# EAGLE schematic cloudArray2 (EAGLE 9.5.1)

## Sheet 1 of 13
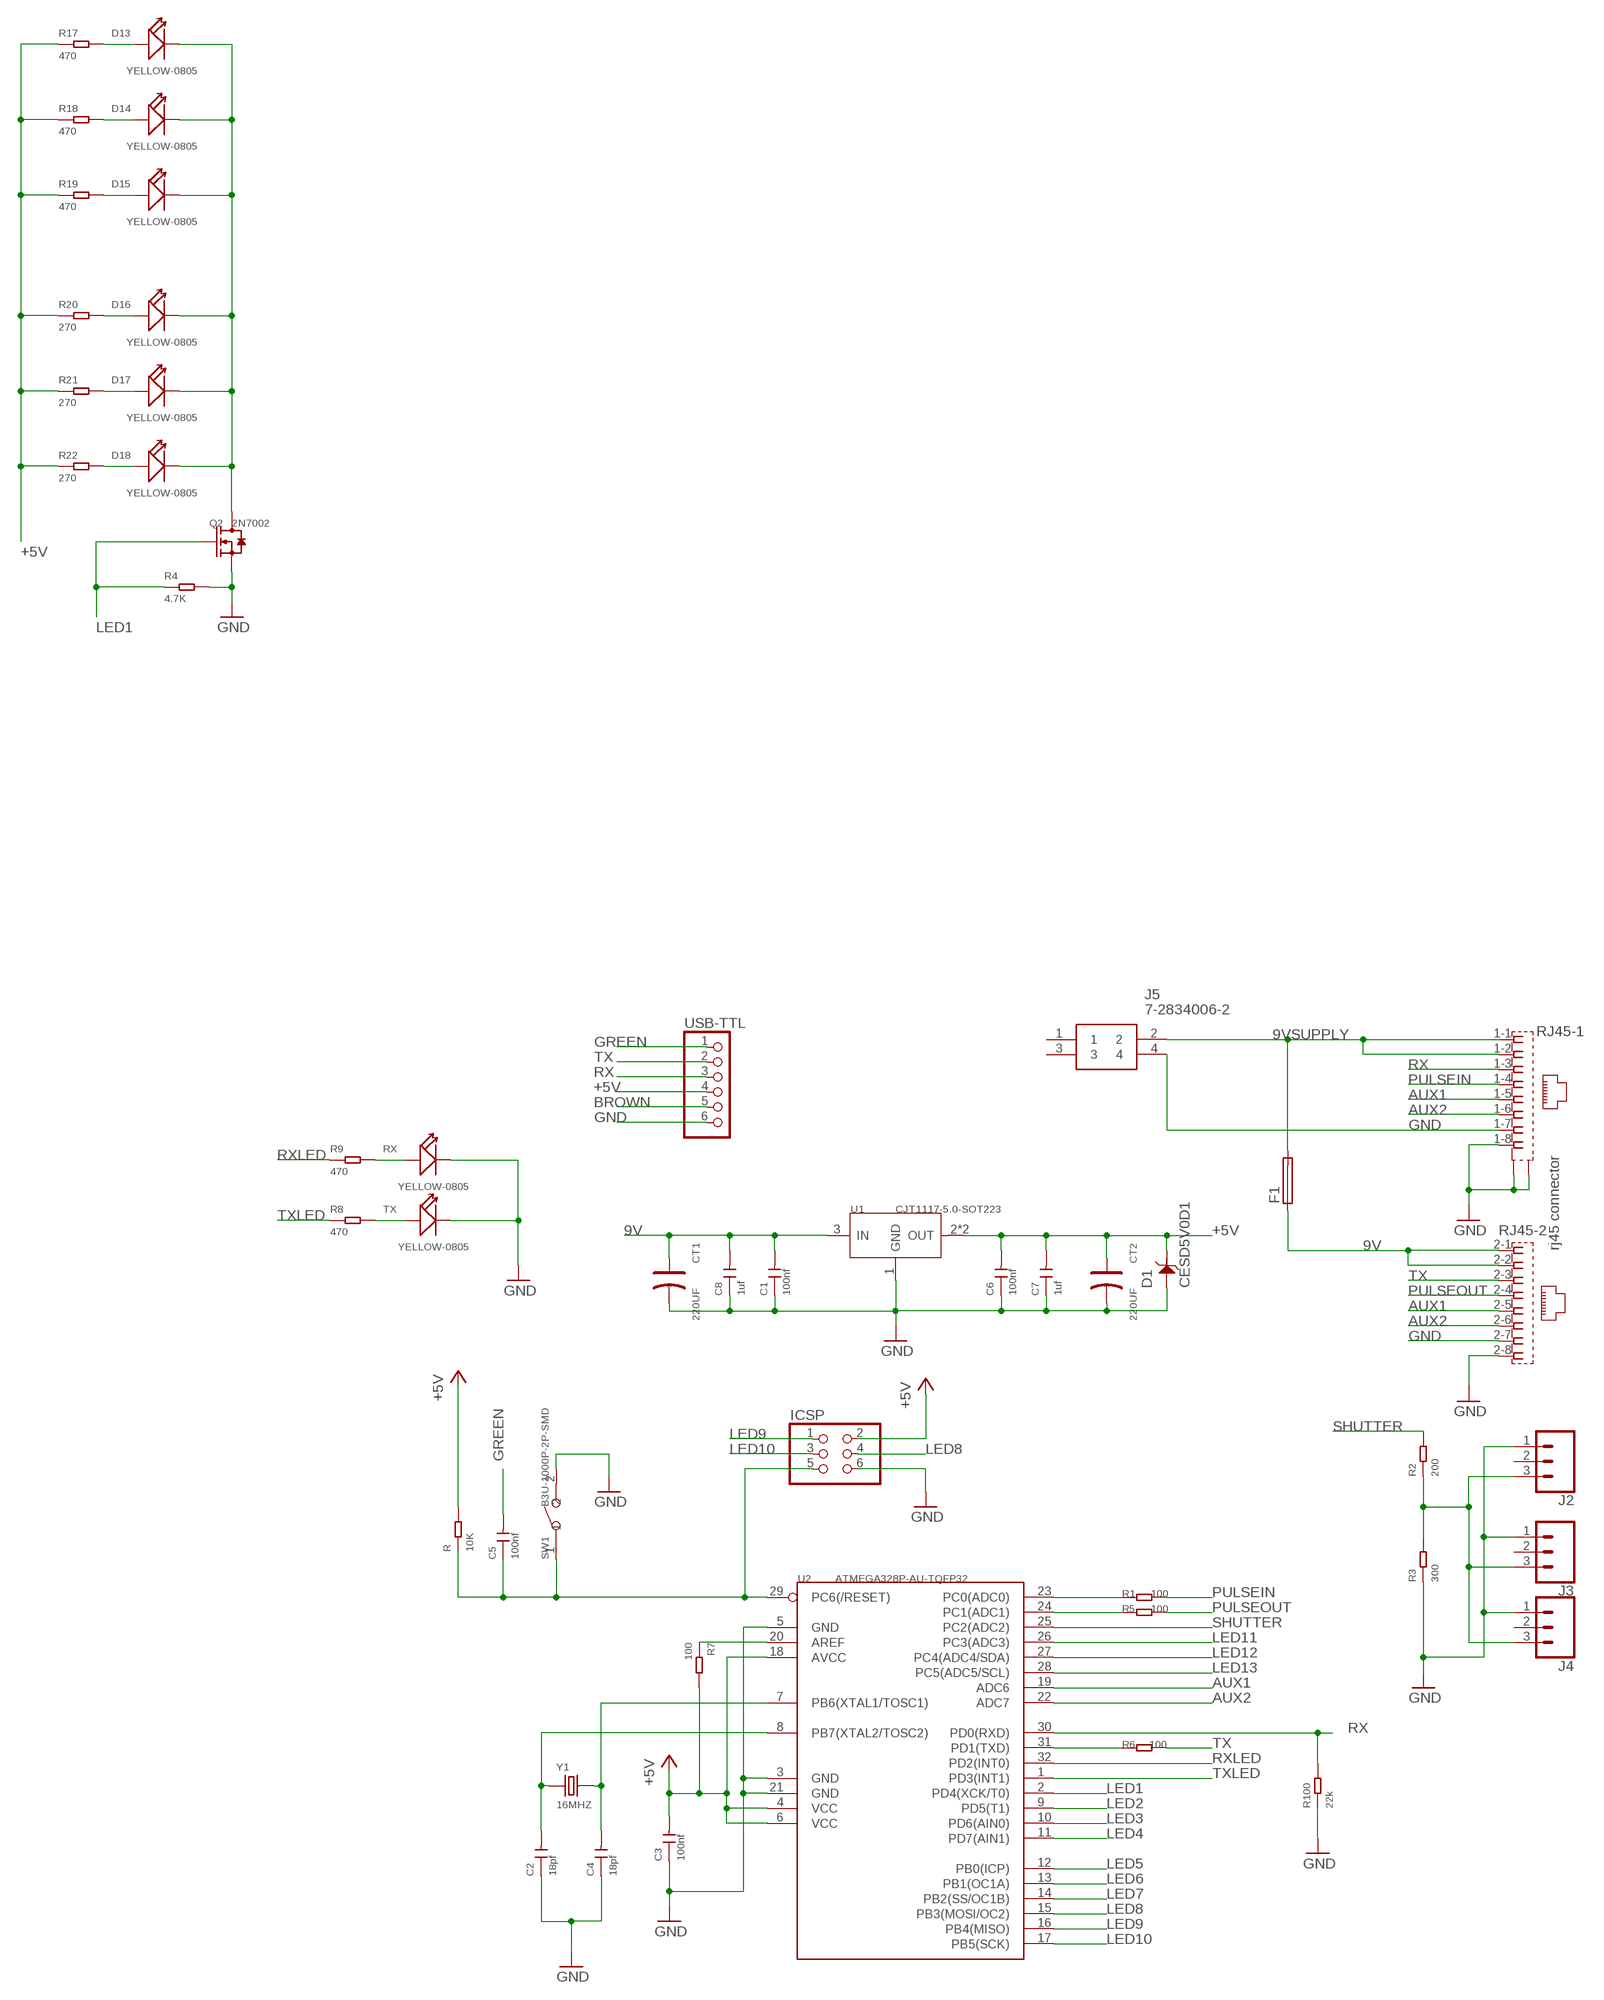
[diagram p0: schematic, sheet 1]

### Parts
C1  100nf  CERAMIC-100NF-50V-10%-X7R(0805)  [C0805]
C2  18pf  CERAMIC-1UF-25V-10%-X7R(0805)  [C0805]
C3  100nf  CERAMIC-10NF-50V-5%-X7R(0805)  [C0805]
C4  18pf  CERAMIC-1UF-25V-10%-X7R(0805)  [C0805]
C5  100nf  CERAMIC-100NF-50V-10%-X7R(0805)  [C0805]
C6  100nf  CERAMIC-100NF-50V-10%-X7R(0805)  [C0805]
C7  1uf  CERAMIC-100NF-50V-10%-X7R(0805)  [C0805]
C8  1uf  CERAMIC-100NF-50V-10%-X7R(0805)  [C0805]
CT1  220UF  ALUMINUM-SMD-220UF-16V(D6.3-H7.7MM)  [ELECTRO-SMD-C-6MM]
CT2  220UF  ALUMINUM-SMD-220UF-16V(D6.3-H7.7MM)  [ELECTRO-SMD-C-6MM]
D1  CESD5V0D1  SMD-DIODE-ESD-6.2V-250MW(SOD-123)  [SOD-123]
D13  YELLOW-0805  SMD-LED-CLEAR-YELLOW(0805)  [LED-0805]
D14  YELLOW-0805  SMD-LED-CLEAR-YELLOW(0805)  [LED-0805]
D15  YELLOW-0805  SMD-LED-CLEAR-YELLOW(0805)  [LED-0805]
D16  YELLOW-0805  SMD-LED-CLEAR-YELLOW(0805)  [LED-0805]
D17  YELLOW-0805  SMD-LED-CLEAR-YELLOW(0805)  [LED-0805]
D18  YELLOW-0805  SMD-LED-CLEAR-YELLOW(0805)  [LED-0805]
F1  SH22,5A  [SH22,5A]
ICSP  PINHD-2X3  [2X03]
J2  455-1750-1-ND  CONN_03  [1X03]
J3  455-1750-1-ND  CONN_03  [1X03]
J4  455-1750-1-ND  CONN_03  [1X03]
J5  7-2834006-2  [728340062]
Q2  2N7002  SMD-MOSFET-N-CH-60V-300MA-LOGIC-LEVEL-FET-2N7002(SOT-23)  [SOT-23]
R  10K  SMD-RES-10K-1%-1/8W(0805)  [R0805]
R1  100  SMD-RES-200R-1%-1/8W(0805)  [R0805]
R2  200  SMD-RES-200R-1%-1/8W(0805)  [R0805]
R3  300  SMD-RES-200R-1%-1/8W(0805)  [R0805]
R4  4.7K  SMD-RES-2.4K-5%-1/8W(0805)  [R0805]
R5  100  SMD-RES-200R-1%-1/8W(0805)  [R0805]
R6  100  SMD-RES-200R-1%-1/8W(0805)  [R0805]
R7  100  SMD-RES-200R-1%-1/8W(0805)  [R0805]
R8  470  SMD-RES-470R-1%-1/8W(0805)  [R0805]
R9  470  SMD-RES-470R-1%-1/8W(0805)  [R0805]
R17  470  SMD-RES-470R-1%-1/8W(0805)  [R0805]
R18  470  SMD-RES-470R-1%-1/8W(0805)  [R0805]
R19  470  SMD-RES-470R-1%-1/8W(0805)  [R0805]
R20  270  SMD-RES-470R-1%-1/8W(0805)  [R0805]
R21  270  SMD-RES-470R-1%-1/8W(0805)  [R0805]
R22  270  SMD-RES-470R-1%-1/8W(0805)  [R0805]
R100  22k  SMD-RES-200R-1%-1/8W(0805)  [R0805]
RJ45  557570-1  [557570-1]
RX  YELLOW-0805  SMD-LED-CLEAR-YELLOW(0805)  [LED-0805]
SW1  B3U-1000P-2P-SMD  SMD-BUTTON(2P-3.0X2.5X1.2+0.4MM)-B3U-1000P-2P-SMD  [SW2-2.6-3.0X2.5X1.2+0.4MM]
TX  YELLOW-0805  SMD-LED-CLEAR-YELLOW(0805)  [LED-0805]
U1  CJT1117-5.0-SOT223  PMIC-CJT1117-5.0(SOT223)  [SOT-223]
U2  ATMEGA328P-AU-TQFP32  MCU-ATMEGA328P-AU(TQFP32)  [TQFP32-0.8-7X7MM]
USB-TTL  PINHD-1X6  [1X06]
Y1  16MHZ  SMD-CRYSTAL-16MHZ-8PF-20PPM-40R(2P-5.0X3.2MM)  [X2-SMD-5.0X3.2X1.3MM]

### Nets
9V: C1.2 C8.2 CT1.+ F1.1 RJ45.2-1 RJ45.2-2 U1.3(IN)
9VSUPPLY: F1.2 J5.2 RJ45.1-1 RJ45.1-2
+5V: C3.2 C6.2 C7.2 CT2.+ D1.- ICSP.2 R7.2 R17.1 R18.1 R19.1 R20.1 R21.1 R22.1 R.2 U1.2(OUT) U1.TER(OUT) U2.4(VCC) U2.6(VCC) U2.18(AVCC) USB-TTL.4 ; also sheet 2,3,4,5,6,7,8,9,10,11,12,13
A0: R1.2 U2.23(PC0(ADC0))
A1: R5.2 U2.24(PC1(ADC1))
AREF: R7.1 U2.20(AREF)
AUX1: RJ45.1-5 RJ45.2-5 U2.19(ADC6)
AUX2: RJ45.1-6 RJ45.2-6 U2.22(ADC7)
BROWN: USB-TTL.5
GND: C1.1 C2.1 C3.1 C4.1 C6.1 C7.1 C8.1 CT1.- CT2.- D1.+ ICSP.6 J2.1 J3.1 J4.1 J5.4 Q2.2(S) R3.1 R4.2 R100.1 RJ45.1-7 RJ45.1-8 RJ45.2-7 RJ45.2-8 RJ45.G1(-1:S2) RJ45.G3(-1:S1) RX.- SW1.2 TX.- U1.1(GND) U2.3(GND) U2.5(GND) U2.21(GND) USB-TTL.6 ; also sheet 2,3,4,5,6,7,8,9,10,11,12,13
GREEN: C5.2 USB-TTL.1
LED1: Q2.1(G) R4.1 U2.2(PD4(XCK/T0))
LED2: U2.9(PD5(T1)) ; also sheet 2
LED3: U2.10(PD6(AIN0)) ; also sheet 3
LED4: U2.11(PD7(AIN1)) ; also sheet 4
LED5: U2.12(PB0(ICP)) ; also sheet 5
LED6: U2.13(PB1(OC1A)) ; also sheet 6
LED7: U2.14(PB2(SS/OC1B)) ; also sheet 7
LED8: ICSP.4 U2.15(PB3(MOSI/OC2)) ; also sheet 8
LED9: ICSP.1 U2.16(PB4(MISO)) ; also sheet 9
LED10: ICSP.3 U2.17(PB5(SCK)) ; also sheet 10
LED11: U2.26(PC3(ADC3)) ; also sheet 11
LED12: U2.27(PC4(ADC4/SDA)) ; also sheet 12
LED13: U2.28(PC5(ADC5/SCL)) ; also sheet 13
N$1: D13.- D14.- D15.- D16.- D17.- D18.- Q2.3(D)
N$3: C2.2 U2.8(PB7(XTAL2/TOSC2)) Y1.1
N$4: C4.2 U2.7(PB6(XTAL1/TOSC1)) Y1.2
N$5: R6.2 U2.31(PD1(TXD))
N$13: R8.2 TX.+
N$20: J2.3 J3.3 J4.3 R2.1 R3.2
N$30: R9.2 RX.+
N$152: D13.+ R17.2
N$153: D14.+ R18.2
N$154: D15.+ R19.2
N$155: D16.+ R20.2
N$156: D17.+ R21.2
N$157: D18.+ R22.2
PULSEIN: R1.1 RJ45.1-4
PULSEOUT: R5.1 RJ45.2-4
RESET: C5.1 ICSP.5 R.1 SW1.1 U2.29(PC6(/RESET))
RX: R100.2 RJ45.1-3 U2.30(PD0(RXD)) USB-TTL.3
RXLED: R9.1 U2.32(PD2(INT0))
SHUTTER: R2.2 U2.25(PC2(ADC2))
TX: R6.1 RJ45.2-3 USB-TTL.2
TXLED: R8.1 U2.1(PD3(INT1))
Unconnected: J2.2 J3.2 J4.2 J5.1 J5.3

### Notes on the sheet
- rj45 connector

## Sheet 2 of 13
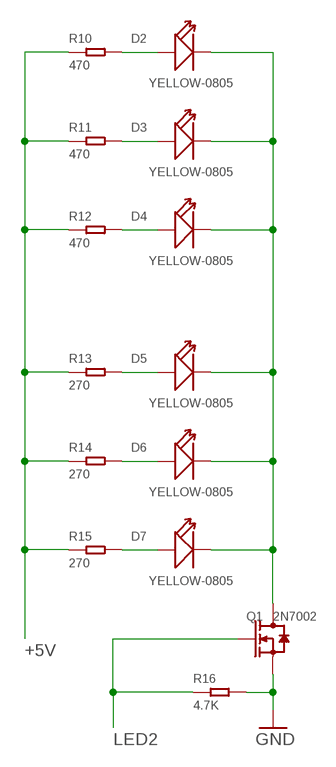
[diagram p1: schematic, sheet 2]

### Parts
D2  YELLOW-0805  SMD-LED-CLEAR-YELLOW(0805)  [LED-0805]
D3  YELLOW-0805  SMD-LED-CLEAR-YELLOW(0805)  [LED-0805]
D4  YELLOW-0805  SMD-LED-CLEAR-YELLOW(0805)  [LED-0805]
D5  YELLOW-0805  SMD-LED-CLEAR-YELLOW(0805)  [LED-0805]
D6  YELLOW-0805  SMD-LED-CLEAR-YELLOW(0805)  [LED-0805]
D7  YELLOW-0805  SMD-LED-CLEAR-YELLOW(0805)  [LED-0805]
Q1  2N7002  SMD-MOSFET-N-CH-60V-300MA-LOGIC-LEVEL-FET-2N7002(SOT-23)  [SOT-23]
R10  470  SMD-RES-470R-1%-1/8W(0805)  [R0805]
R11  470  SMD-RES-470R-1%-1/8W(0805)  [R0805]
R12  470  SMD-RES-470R-1%-1/8W(0805)  [R0805]
R13  270  SMD-RES-470R-1%-1/8W(0805)  [R0805]
R14  270  SMD-RES-470R-1%-1/8W(0805)  [R0805]
R15  270  SMD-RES-470R-1%-1/8W(0805)  [R0805]
R16  4.7K  SMD-RES-2.4K-5%-1/8W(0805)  [R0805]

### Nets
+5V: R10.1 R11.1 R12.1 R13.1 R14.1 R15.1 ; also sheet 1,3,4,5,6,7,8,9,10,11,12,13
GND: Q1.2(S) R16.2 ; also sheet 1,3,4,5,6,7,8,9,10,11,12,13
LED2: Q1.1(G) R16.1 ; also sheet 1
N$28: D2.+ R10.2
N$29: D3.+ R11.2
N$31: D4.+ R12.2
N$32: D5.+ R13.2
N$33: D6.+ R14.2
N$34: D7.+ R15.2
N$35: D2.- D3.- D4.- D5.- D6.- D7.- Q1.3(D)

## Sheet 3 of 13
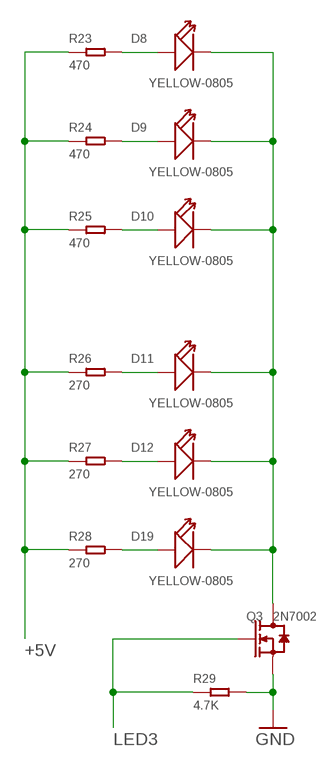
[diagram p2: schematic, sheet 3]

### Parts
D8  YELLOW-0805  SMD-LED-CLEAR-YELLOW(0805)  [LED-0805]
D9  YELLOW-0805  SMD-LED-CLEAR-YELLOW(0805)  [LED-0805]
D10  YELLOW-0805  SMD-LED-CLEAR-YELLOW(0805)  [LED-0805]
D11  YELLOW-0805  SMD-LED-CLEAR-YELLOW(0805)  [LED-0805]
D12  YELLOW-0805  SMD-LED-CLEAR-YELLOW(0805)  [LED-0805]
D19  YELLOW-0805  SMD-LED-CLEAR-YELLOW(0805)  [LED-0805]
Q3  2N7002  SMD-MOSFET-N-CH-60V-300MA-LOGIC-LEVEL-FET-2N7002(SOT-23)  [SOT-23]
R23  470  SMD-RES-470R-1%-1/8W(0805)  [R0805]
R24  470  SMD-RES-470R-1%-1/8W(0805)  [R0805]
R25  470  SMD-RES-470R-1%-1/8W(0805)  [R0805]
R26  270  SMD-RES-470R-1%-1/8W(0805)  [R0805]
R27  270  SMD-RES-470R-1%-1/8W(0805)  [R0805]
R28  270  SMD-RES-470R-1%-1/8W(0805)  [R0805]
R29  4.7K  SMD-RES-2.4K-5%-1/8W(0805)  [R0805]

### Nets
+5V: R23.1 R24.1 R25.1 R26.1 R27.1 R28.1 ; also sheet 1,2,4,5,6,7,8,9,10,11,12,13
GND: Q3.2(S) R29.2 ; also sheet 1,2,4,5,6,7,8,9,10,11,12,13
LED3: Q3.1(G) R29.1 ; also sheet 1
N$36: D8.+ R23.2
N$37: D9.+ R24.2
N$38: D10.+ R25.2
N$39: D11.+ R26.2
N$40: D12.+ R27.2
N$41: D19.+ R28.2
N$42: D8.- D9.- D10.- D11.- D12.- D19.- Q3.3(D)

## Sheet 4 of 13
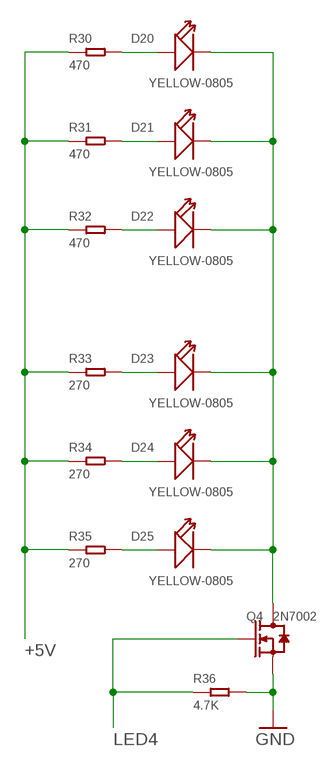
[diagram p3: schematic, sheet 4]

### Parts
D20  YELLOW-0805  SMD-LED-CLEAR-YELLOW(0805)  [LED-0805]
D21  YELLOW-0805  SMD-LED-CLEAR-YELLOW(0805)  [LED-0805]
D22  YELLOW-0805  SMD-LED-CLEAR-YELLOW(0805)  [LED-0805]
D23  YELLOW-0805  SMD-LED-CLEAR-YELLOW(0805)  [LED-0805]
D24  YELLOW-0805  SMD-LED-CLEAR-YELLOW(0805)  [LED-0805]
D25  YELLOW-0805  SMD-LED-CLEAR-YELLOW(0805)  [LED-0805]
Q4  2N7002  SMD-MOSFET-N-CH-60V-300MA-LOGIC-LEVEL-FET-2N7002(SOT-23)  [SOT-23]
R30  470  SMD-RES-470R-1%-1/8W(0805)  [R0805]
R31  470  SMD-RES-470R-1%-1/8W(0805)  [R0805]
R32  470  SMD-RES-470R-1%-1/8W(0805)  [R0805]
R33  270  SMD-RES-470R-1%-1/8W(0805)  [R0805]
R34  270  SMD-RES-470R-1%-1/8W(0805)  [R0805]
R35  270  SMD-RES-470R-1%-1/8W(0805)  [R0805]
R36  4.7K  SMD-RES-2.4K-5%-1/8W(0805)  [R0805]

### Nets
+5V: R30.1 R31.1 R32.1 R33.1 R34.1 R35.1 ; also sheet 1,2,3,5,6,7,8,9,10,11,12,13
GND: Q4.2(S) R36.2 ; also sheet 1,2,3,5,6,7,8,9,10,11,12,13
LED4: Q4.1(G) R36.1 ; also sheet 1
N$43: D20.+ R30.2
N$44: D21.+ R31.2
N$45: D22.+ R32.2
N$46: D23.+ R33.2
N$47: D24.+ R34.2
N$48: D25.+ R35.2
N$49: D20.- D21.- D22.- D23.- D24.- D25.- Q4.3(D)

## Sheet 5 of 13
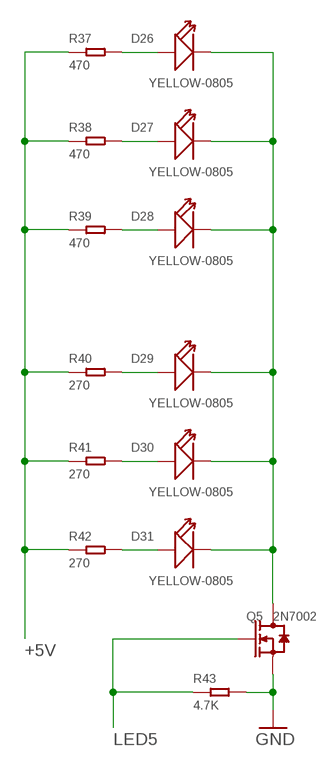
[diagram p4: schematic, sheet 5]

### Parts
D26  YELLOW-0805  SMD-LED-CLEAR-YELLOW(0805)  [LED-0805]
D27  YELLOW-0805  SMD-LED-CLEAR-YELLOW(0805)  [LED-0805]
D28  YELLOW-0805  SMD-LED-CLEAR-YELLOW(0805)  [LED-0805]
D29  YELLOW-0805  SMD-LED-CLEAR-YELLOW(0805)  [LED-0805]
D30  YELLOW-0805  SMD-LED-CLEAR-YELLOW(0805)  [LED-0805]
D31  YELLOW-0805  SMD-LED-CLEAR-YELLOW(0805)  [LED-0805]
Q5  2N7002  SMD-MOSFET-N-CH-60V-300MA-LOGIC-LEVEL-FET-2N7002(SOT-23)  [SOT-23]
R37  470  SMD-RES-470R-1%-1/8W(0805)  [R0805]
R38  470  SMD-RES-470R-1%-1/8W(0805)  [R0805]
R39  470  SMD-RES-470R-1%-1/8W(0805)  [R0805]
R40  270  SMD-RES-470R-1%-1/8W(0805)  [R0805]
R41  270  SMD-RES-470R-1%-1/8W(0805)  [R0805]
R42  270  SMD-RES-470R-1%-1/8W(0805)  [R0805]
R43  4.7K  SMD-RES-2.4K-5%-1/8W(0805)  [R0805]

### Nets
+5V: R37.1 R38.1 R39.1 R40.1 R41.1 R42.1 ; also sheet 1,2,3,4,6,7,8,9,10,11,12,13
GND: Q5.2(S) R43.2 ; also sheet 1,2,3,4,6,7,8,9,10,11,12,13
LED5: Q5.1(G) R43.1 ; also sheet 1
N$50: D26.+ R37.2
N$51: D27.+ R38.2
N$52: D28.+ R39.2
N$53: D29.+ R40.2
N$54: D30.+ R41.2
N$55: D31.+ R42.2
N$56: D26.- D27.- D28.- D29.- D30.- D31.- Q5.3(D)

## Sheet 6 of 13
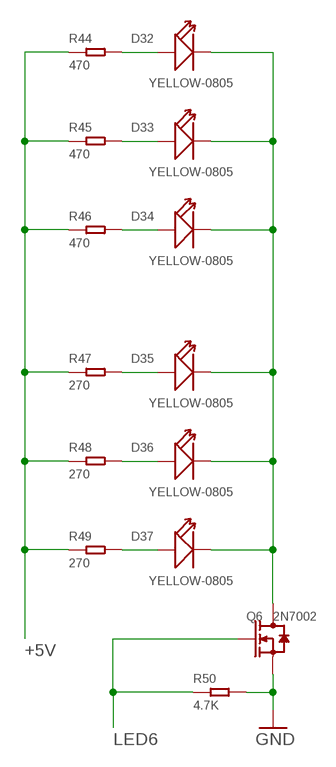
[diagram p5: schematic, sheet 6]

### Parts
D32  YELLOW-0805  SMD-LED-CLEAR-YELLOW(0805)  [LED-0805]
D33  YELLOW-0805  SMD-LED-CLEAR-YELLOW(0805)  [LED-0805]
D34  YELLOW-0805  SMD-LED-CLEAR-YELLOW(0805)  [LED-0805]
D35  YELLOW-0805  SMD-LED-CLEAR-YELLOW(0805)  [LED-0805]
D36  YELLOW-0805  SMD-LED-CLEAR-YELLOW(0805)  [LED-0805]
D37  YELLOW-0805  SMD-LED-CLEAR-YELLOW(0805)  [LED-0805]
Q6  2N7002  SMD-MOSFET-N-CH-60V-300MA-LOGIC-LEVEL-FET-2N7002(SOT-23)  [SOT-23]
R44  470  SMD-RES-470R-1%-1/8W(0805)  [R0805]
R45  470  SMD-RES-470R-1%-1/8W(0805)  [R0805]
R46  470  SMD-RES-470R-1%-1/8W(0805)  [R0805]
R47  270  SMD-RES-470R-1%-1/8W(0805)  [R0805]
R48  270  SMD-RES-470R-1%-1/8W(0805)  [R0805]
R49  270  SMD-RES-470R-1%-1/8W(0805)  [R0805]
R50  4.7K  SMD-RES-2.4K-5%-1/8W(0805)  [R0805]

### Nets
+5V: R44.1 R45.1 R46.1 R47.1 R48.1 R49.1 ; also sheet 1,2,3,4,5,7,8,9,10,11,12,13
GND: Q6.2(S) R50.2 ; also sheet 1,2,3,4,5,7,8,9,10,11,12,13
LED6: Q6.1(G) R50.1 ; also sheet 1
N$57: D32.+ R44.2
N$58: D33.+ R45.2
N$59: D34.+ R46.2
N$60: D35.+ R47.2
N$61: D36.+ R48.2
N$62: D37.+ R49.2
N$63: D32.- D33.- D34.- D35.- D36.- D37.- Q6.3(D)

## Sheet 7 of 13
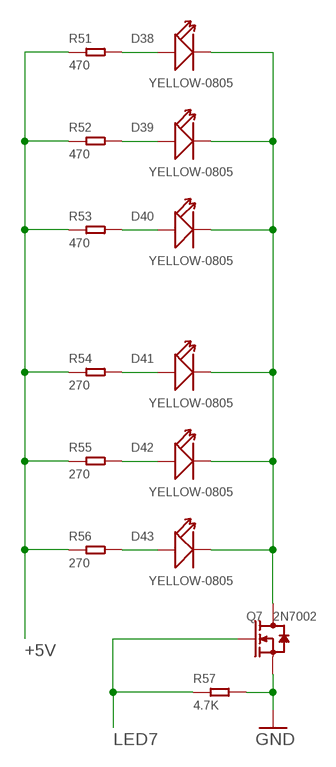
[diagram p6: schematic, sheet 7]

### Parts
D38  YELLOW-0805  SMD-LED-CLEAR-YELLOW(0805)  [LED-0805]
D39  YELLOW-0805  SMD-LED-CLEAR-YELLOW(0805)  [LED-0805]
D40  YELLOW-0805  SMD-LED-CLEAR-YELLOW(0805)  [LED-0805]
D41  YELLOW-0805  SMD-LED-CLEAR-YELLOW(0805)  [LED-0805]
D42  YELLOW-0805  SMD-LED-CLEAR-YELLOW(0805)  [LED-0805]
D43  YELLOW-0805  SMD-LED-CLEAR-YELLOW(0805)  [LED-0805]
Q7  2N7002  SMD-MOSFET-N-CH-60V-300MA-LOGIC-LEVEL-FET-2N7002(SOT-23)  [SOT-23]
R51  470  SMD-RES-470R-1%-1/8W(0805)  [R0805]
R52  470  SMD-RES-470R-1%-1/8W(0805)  [R0805]
R53  470  SMD-RES-470R-1%-1/8W(0805)  [R0805]
R54  270  SMD-RES-470R-1%-1/8W(0805)  [R0805]
R55  270  SMD-RES-470R-1%-1/8W(0805)  [R0805]
R56  270  SMD-RES-470R-1%-1/8W(0805)  [R0805]
R57  4.7K  SMD-RES-2.4K-5%-1/8W(0805)  [R0805]

### Nets
+5V: R51.1 R52.1 R53.1 R54.1 R55.1 R56.1 ; also sheet 1,2,3,4,5,6,8,9,10,11,12,13
GND: Q7.2(S) R57.2 ; also sheet 1,2,3,4,5,6,8,9,10,11,12,13
LED7: Q7.1(G) R57.1 ; also sheet 1
N$64: D38.+ R51.2
N$65: D39.+ R52.2
N$66: D40.+ R53.2
N$67: D41.+ R54.2
N$68: D42.+ R55.2
N$69: D43.+ R56.2
N$70: D38.- D39.- D40.- D41.- D42.- D43.- Q7.3(D)

## Sheet 8 of 13
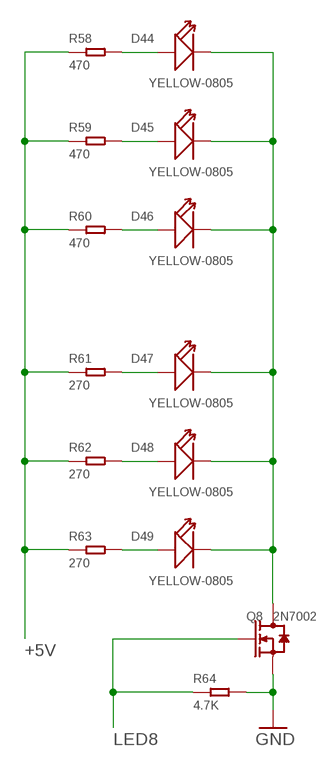
[diagram p7: schematic, sheet 8]

### Parts
D44  YELLOW-0805  SMD-LED-CLEAR-YELLOW(0805)  [LED-0805]
D45  YELLOW-0805  SMD-LED-CLEAR-YELLOW(0805)  [LED-0805]
D46  YELLOW-0805  SMD-LED-CLEAR-YELLOW(0805)  [LED-0805]
D47  YELLOW-0805  SMD-LED-CLEAR-YELLOW(0805)  [LED-0805]
D48  YELLOW-0805  SMD-LED-CLEAR-YELLOW(0805)  [LED-0805]
D49  YELLOW-0805  SMD-LED-CLEAR-YELLOW(0805)  [LED-0805]
Q8  2N7002  SMD-MOSFET-N-CH-60V-300MA-LOGIC-LEVEL-FET-2N7002(SOT-23)  [SOT-23]
R58  470  SMD-RES-470R-1%-1/8W(0805)  [R0805]
R59  470  SMD-RES-470R-1%-1/8W(0805)  [R0805]
R60  470  SMD-RES-470R-1%-1/8W(0805)  [R0805]
R61  270  SMD-RES-470R-1%-1/8W(0805)  [R0805]
R62  270  SMD-RES-470R-1%-1/8W(0805)  [R0805]
R63  270  SMD-RES-470R-1%-1/8W(0805)  [R0805]
R64  4.7K  SMD-RES-2.4K-5%-1/8W(0805)  [R0805]

### Nets
+5V: R58.1 R59.1 R60.1 R61.1 R62.1 R63.1 ; also sheet 1,2,3,4,5,6,7,9,10,11,12,13
GND: Q8.2(S) R64.2 ; also sheet 1,2,3,4,5,6,7,9,10,11,12,13
LED8: Q8.1(G) R64.1 ; also sheet 1
N$71: D44.+ R58.2
N$72: D45.+ R59.2
N$73: D46.+ R60.2
N$74: D47.+ R61.2
N$75: D48.+ R62.2
N$76: D49.+ R63.2
N$77: D44.- D45.- D46.- D47.- D48.- D49.- Q8.3(D)

## Sheet 9 of 13
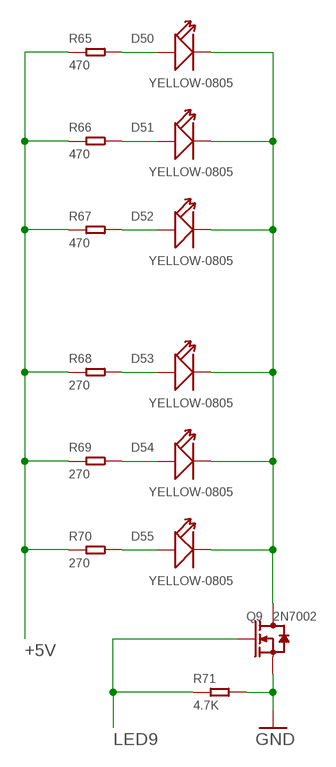
[diagram p8: schematic, sheet 9]

### Parts
D50  YELLOW-0805  SMD-LED-CLEAR-YELLOW(0805)  [LED-0805]
D51  YELLOW-0805  SMD-LED-CLEAR-YELLOW(0805)  [LED-0805]
D52  YELLOW-0805  SMD-LED-CLEAR-YELLOW(0805)  [LED-0805]
D53  YELLOW-0805  SMD-LED-CLEAR-YELLOW(0805)  [LED-0805]
D54  YELLOW-0805  SMD-LED-CLEAR-YELLOW(0805)  [LED-0805]
D55  YELLOW-0805  SMD-LED-CLEAR-YELLOW(0805)  [LED-0805]
Q9  2N7002  SMD-MOSFET-N-CH-60V-300MA-LOGIC-LEVEL-FET-2N7002(SOT-23)  [SOT-23]
R65  470  SMD-RES-470R-1%-1/8W(0805)  [R0805]
R66  470  SMD-RES-470R-1%-1/8W(0805)  [R0805]
R67  470  SMD-RES-470R-1%-1/8W(0805)  [R0805]
R68  270  SMD-RES-470R-1%-1/8W(0805)  [R0805]
R69  270  SMD-RES-470R-1%-1/8W(0805)  [R0805]
R70  270  SMD-RES-470R-1%-1/8W(0805)  [R0805]
R71  4.7K  SMD-RES-2.4K-5%-1/8W(0805)  [R0805]

### Nets
+5V: R65.1 R66.1 R67.1 R68.1 R69.1 R70.1 ; also sheet 1,2,3,4,5,6,7,8,10,11,12,13
GND: Q9.2(S) R71.2 ; also sheet 1,2,3,4,5,6,7,8,10,11,12,13
LED9: Q9.1(G) R71.1 ; also sheet 1
N$78: D50.+ R65.2
N$79: D51.+ R66.2
N$80: D52.+ R67.2
N$81: D53.+ R68.2
N$82: D54.+ R69.2
N$83: D55.+ R70.2
N$84: D50.- D51.- D52.- D53.- D54.- D55.- Q9.3(D)

## Sheet 10 of 13
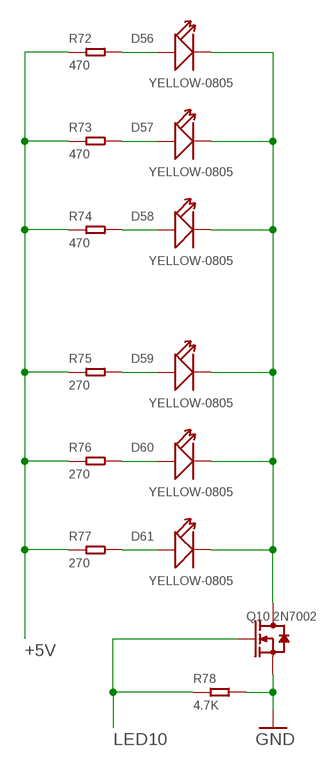
[diagram p9: schematic, sheet 10]

### Parts
D56  YELLOW-0805  SMD-LED-CLEAR-YELLOW(0805)  [LED-0805]
D57  YELLOW-0805  SMD-LED-CLEAR-YELLOW(0805)  [LED-0805]
D58  YELLOW-0805  SMD-LED-CLEAR-YELLOW(0805)  [LED-0805]
D59  YELLOW-0805  SMD-LED-CLEAR-YELLOW(0805)  [LED-0805]
D60  YELLOW-0805  SMD-LED-CLEAR-YELLOW(0805)  [LED-0805]
D61  YELLOW-0805  SMD-LED-CLEAR-YELLOW(0805)  [LED-0805]
Q10  2N7002  SMD-MOSFET-N-CH-60V-300MA-LOGIC-LEVEL-FET-2N7002(SOT-23)  [SOT-23]
R72  470  SMD-RES-470R-1%-1/8W(0805)  [R0805]
R73  470  SMD-RES-470R-1%-1/8W(0805)  [R0805]
R74  470  SMD-RES-470R-1%-1/8W(0805)  [R0805]
R75  270  SMD-RES-470R-1%-1/8W(0805)  [R0805]
R76  270  SMD-RES-470R-1%-1/8W(0805)  [R0805]
R77  270  SMD-RES-470R-1%-1/8W(0805)  [R0805]
R78  4.7K  SMD-RES-2.4K-5%-1/8W(0805)  [R0805]

### Nets
+5V: R72.1 R73.1 R74.1 R75.1 R76.1 R77.1 ; also sheet 1,2,3,4,5,6,7,8,9,11,12,13
GND: Q10.2(S) R78.2 ; also sheet 1,2,3,4,5,6,7,8,9,11,12,13
LED10: Q10.1(G) R78.1 ; also sheet 1
N$85: D56.+ R72.2
N$86: D57.+ R73.2
N$87: D58.+ R74.2
N$88: D59.+ R75.2
N$89: D60.+ R76.2
N$90: D61.+ R77.2
N$91: D56.- D57.- D58.- D59.- D60.- D61.- Q10.3(D)

## Sheet 11 of 13
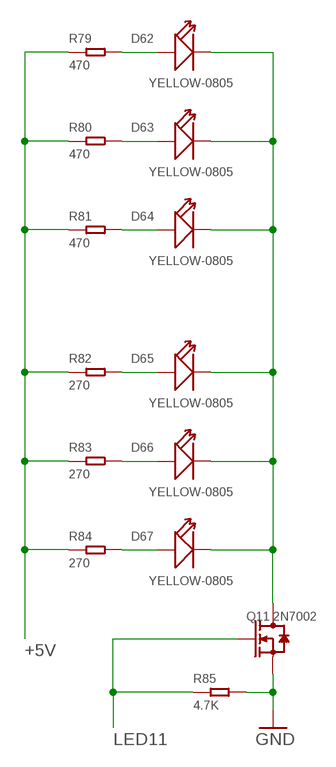
[diagram p10: schematic, sheet 11]

### Parts
D62  YELLOW-0805  SMD-LED-CLEAR-YELLOW(0805)  [LED-0805]
D63  YELLOW-0805  SMD-LED-CLEAR-YELLOW(0805)  [LED-0805]
D64  YELLOW-0805  SMD-LED-CLEAR-YELLOW(0805)  [LED-0805]
D65  YELLOW-0805  SMD-LED-CLEAR-YELLOW(0805)  [LED-0805]
D66  YELLOW-0805  SMD-LED-CLEAR-YELLOW(0805)  [LED-0805]
D67  YELLOW-0805  SMD-LED-CLEAR-YELLOW(0805)  [LED-0805]
Q11  2N7002  SMD-MOSFET-N-CH-60V-300MA-LOGIC-LEVEL-FET-2N7002(SOT-23)  [SOT-23]
R79  470  SMD-RES-470R-1%-1/8W(0805)  [R0805]
R80  470  SMD-RES-470R-1%-1/8W(0805)  [R0805]
R81  470  SMD-RES-470R-1%-1/8W(0805)  [R0805]
R82  270  SMD-RES-470R-1%-1/8W(0805)  [R0805]
R83  270  SMD-RES-470R-1%-1/8W(0805)  [R0805]
R84  270  SMD-RES-470R-1%-1/8W(0805)  [R0805]
R85  4.7K  SMD-RES-2.4K-5%-1/8W(0805)  [R0805]

### Nets
+5V: R79.1 R80.1 R81.1 R82.1 R83.1 R84.1 ; also sheet 1,2,3,4,5,6,7,8,9,10,12,13
GND: Q11.2(S) R85.2 ; also sheet 1,2,3,4,5,6,7,8,9,10,12,13
LED11: Q11.1(G) R85.1 ; also sheet 1
N$92: D62.+ R79.2
N$93: D63.+ R80.2
N$94: D64.+ R81.2
N$95: D65.+ R82.2
N$96: D66.+ R83.2
N$97: D67.+ R84.2
N$98: D62.- D63.- D64.- D65.- D66.- D67.- Q11.3(D)

## Sheet 12 of 13
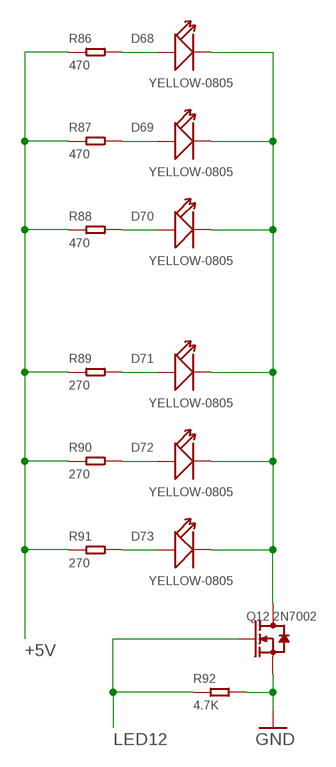
[diagram p11: schematic, sheet 12]

### Parts
D68  YELLOW-0805  SMD-LED-CLEAR-YELLOW(0805)  [LED-0805]
D69  YELLOW-0805  SMD-LED-CLEAR-YELLOW(0805)  [LED-0805]
D70  YELLOW-0805  SMD-LED-CLEAR-YELLOW(0805)  [LED-0805]
D71  YELLOW-0805  SMD-LED-CLEAR-YELLOW(0805)  [LED-0805]
D72  YELLOW-0805  SMD-LED-CLEAR-YELLOW(0805)  [LED-0805]
D73  YELLOW-0805  SMD-LED-CLEAR-YELLOW(0805)  [LED-0805]
Q12  2N7002  SMD-MOSFET-N-CH-60V-300MA-LOGIC-LEVEL-FET-2N7002(SOT-23)  [SOT-23]
R86  470  SMD-RES-470R-1%-1/8W(0805)  [R0805]
R87  470  SMD-RES-470R-1%-1/8W(0805)  [R0805]
R88  470  SMD-RES-470R-1%-1/8W(0805)  [R0805]
R89  270  SMD-RES-470R-1%-1/8W(0805)  [R0805]
R90  270  SMD-RES-470R-1%-1/8W(0805)  [R0805]
R91  270  SMD-RES-470R-1%-1/8W(0805)  [R0805]
R92  4.7K  SMD-RES-2.4K-5%-1/8W(0805)  [R0805]

### Nets
+5V: R86.1 R87.1 R88.1 R89.1 R90.1 R91.1 ; also sheet 1,2,3,4,5,6,7,8,9,10,11,13
GND: Q12.2(S) R92.2 ; also sheet 1,2,3,4,5,6,7,8,9,10,11,13
LED12: Q12.1(G) R92.1 ; also sheet 1
N$17: D68.+ R86.2
N$99: D69.+ R87.2
N$100: D70.+ R88.2
N$101: D71.+ R89.2
N$102: D72.+ R90.2
N$103: D73.+ R91.2
N$104: D68.- D69.- D70.- D71.- D72.- D73.- Q12.3(D)

## Sheet 13 of 13
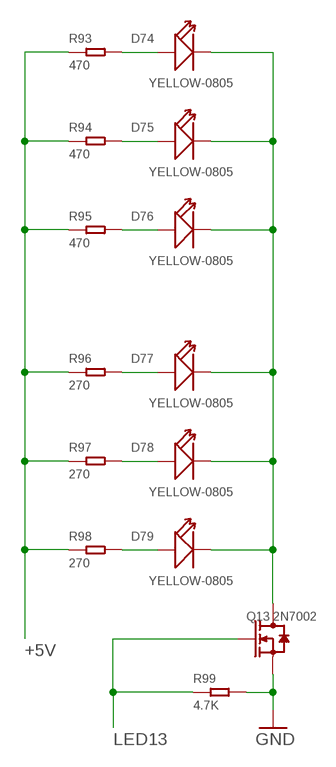
[diagram p12: schematic, sheet 13]

### Parts
D74  YELLOW-0805  SMD-LED-CLEAR-YELLOW(0805)  [LED-0805]
D75  YELLOW-0805  SMD-LED-CLEAR-YELLOW(0805)  [LED-0805]
D76  YELLOW-0805  SMD-LED-CLEAR-YELLOW(0805)  [LED-0805]
D77  YELLOW-0805  SMD-LED-CLEAR-YELLOW(0805)  [LED-0805]
D78  YELLOW-0805  SMD-LED-CLEAR-YELLOW(0805)  [LED-0805]
D79  YELLOW-0805  SMD-LED-CLEAR-YELLOW(0805)  [LED-0805]
Q13  2N7002  SMD-MOSFET-N-CH-60V-300MA-LOGIC-LEVEL-FET-2N7002(SOT-23)  [SOT-23]
R93  470  SMD-RES-470R-1%-1/8W(0805)  [R0805]
R94  470  SMD-RES-470R-1%-1/8W(0805)  [R0805]
R95  470  SMD-RES-470R-1%-1/8W(0805)  [R0805]
R96  270  SMD-RES-470R-1%-1/8W(0805)  [R0805]
R97  270  SMD-RES-470R-1%-1/8W(0805)  [R0805]
R98  270  SMD-RES-470R-1%-1/8W(0805)  [R0805]
R99  4.7K  SMD-RES-2.4K-5%-1/8W(0805)  [R0805]

### Nets
+5V: R93.1 R94.1 R95.1 R96.1 R97.1 R98.1 ; also sheet 1,2,3,4,5,6,7,8,9,10,11,12
GND: Q13.2(S) R99.2 ; also sheet 1,2,3,4,5,6,7,8,9,10,11,12
LED13: Q13.1(G) R99.1 ; also sheet 1
N$105: D74.+ R93.2
N$106: D75.+ R94.2
N$107: D76.+ R95.2
N$108: D77.+ R96.2
N$109: D78.+ R97.2
N$110: D79.+ R98.2
N$111: D74.- D75.- D76.- D77.- D78.- D79.- Q13.3(D)

## Library data of the parts
C1 C5 C6 = OPL_Capacitor:CERAMIC-100NF-50V-10%-X7R(0805): 302010165; MPN: CC0805KRX7R9BB104
C2 C4 = OPL_Capacitor:CERAMIC-1UF-25V-10%-X7R(0805): 302010179; MPN: CC0805KKX7R8BB105; VALUE: 1uf
C3 = OPL_Capacitor:CERAMIC-10NF-50V-5%-X7R(0805): 302010175; MPN: CC0805JRX7R9BB103; VALUE: 10nf
C7 C8 = OPL_Capacitor:CERAMIC-100NF-50V-10%-X7R(0805): 302010165; MPN: CC0805KRX7R9BB104; VALUE: 100nf
CT1 CT2 = OPL_Capacitor:ALUMINUM-SMD-220UF-16V(D6.3-H7.7MM): 302030053; MPN: CS1E221M-CRE77
D1 = OPL_Circuit_Protection:SMD-DIODE-ESD-6.2V-250MW(SOD-123): 304060001; MPN: CESD5V0D1
D2-D79 RX TX = OPL_Optoelectronics:SMD-LED-CLEAR-YELLOW(0805): 304090039; MPN: 17-215UYC/S530-A3/TR8
F1 = fuse:SH22,5A: FUSE HOLDER grid 22,5mm, isolated cap OGN0031 8201, Schurter (Buerklin); MPN: 0031.7701.11; OC_FARNELL: unknown; OC_NEWARK: 04F1224
ICSP = SparkFun-Connectors:PINHD-2X3: PIN HEADER
J2-J4 = SparkFun-Connectors:CONN_03: Multi connection point. Often used as Generic Header-pin footprint for 0.1 inch spaced/style header connections On any of the 0.1 inch spaced packages, you can populate with these: Break Away Headers - Straight <https://www.sparkfun.com/products/116> (PRT-00116) Break Away Male Headers - Right Angle <https://www.sparkfun.com/products/553> (PRT-00553) Female Headers <https://www.sparkfun.com/products/115> (PRT-00115) Break Away Headers - Machine Pin <https://www.sparkfun.com/products/117> (PRT-00117) Break Away Female Headers - Swiss Machine Pin <https://www.sparkfun.com/products/743> (PRT-00743) Stackable Header - 3 Pin (Female, 0.1") <https://www.sparkfun.com/products/13875> (PRT-13875) For SCREWTERMINALS and SPRING TERMINALS visit here: Screw Terimnals on SparkFun.com <https://www.sparkfun.com/search/results?term=Screw+Terminals> (5mm/3.5mm/2.54mm spacing) This device is also useful as a general connection point to wire up your design to another part of your project. Our various solder wires solder well into these plated through hole pads. Hook-Up Wire - Assortment (Stranded, 22 AWG) <https://www.sparkfun.com/products/11375> (PRT-11375) Hook-Up Wire - Assortment (Solid Core, 22 AWG) <https://www.sparkfun.com/products/11367> (PRT-11367) View the entire wire category on our website here <https://www.sparkfun.com/categories/141> Special notes: Molex polarized connector foot print use with SKU : PRT-08232 with associated crimp pins and housings.; PROD_ID: XXX-00000
J5 = SamacSys_Parts:7-2834006-2: Lighting Connectors 2P MRPK CONN RD/BK Source: Datasheet <https://componentsearchengine.com/Datasheets/1/7-2834006-2.pdf>; DESCRIPTION: Lighting Connectors 2P MRPK CONN RD/BK; HEIGHT: 4.61mm; MANUFACTURER_NAME: TE Connectivity; MANUFACTURER_PART_NUMBER: 7-2834006-2; MOUSER_PART_NUMBER: 571-7-2834006-2; MOUSER_PRICE-STOCK: https://www.mouser.com/Search/Refine.aspx?Keyword=571-7-2834006-2
Q1-Q13 = OPL_Discrete_Semiconductor:SMD-MOSFET-N-CH-60V-300MA-LOGIC-LEVEL-FET-2N7002(SOT-23): 305030028; MPN: 2N7002,215
R = OPL_Resistor:SMD-RES-10K-1%-1/8W(0805): 301012152; MPN: RC0805FR-0710KL
R1-R3 R5-R7 R100 = OPL_Resistor:SMD-RES-200R-1%-1/8W(0805): 301012159; MPN: RC0805JR-071KL; VALUE: 1K
R4 R16 R29 R36 R43 R50 R57 R64 R71 R78 R85 R92 R99 = OPL_Resistor:SMD-RES-2.4K-5%-1/8W(0805): 301012194; MPN: RC0805JR-071KL; VALUE: 1K
R8-R15 R17-R28 R30-R35 R37-R42 R44-R49 R51-R56 R58-R63 R65-R70 R72-R77 R79-R84 R86-R91 R93-R98 = OPL_Resistor:SMD-RES-470R-1%-1/8W(0805): 301012173; MPN: RC0805JR-071KL; VALUE: 1K
RJ45 = con-amp:557570-1: AMP connector
SW1 = OPL_Switch:SMD-BUTTON(2P-3.0X2.5X1.2+0.4MM): 311020047; MPN: B3U-1000P-2P-SMD
U1 = OPL_IC:PMIC-CJT1117-5.0(SOT223): 310030096; MPN: CJT1117-5.0
U2 = OPL_IC:MCU-ATMEGA328P-AU(TQFP32): 310010049; MPN: ATMEGA328P-AU
USB-TTL = pinhead:PINHD-1X6: PIN HEADER
Y1 = OPL_Crystal Oscillator:SMD-CRYSTAL-16MHZ-8PF-20PPM-40R(2P-5.0X3.2MM): 306010054; MPN: X053201602002

## Net classes
0 default: width 0.508 mm